# Altium schematic sheet main.SchDoc
size C
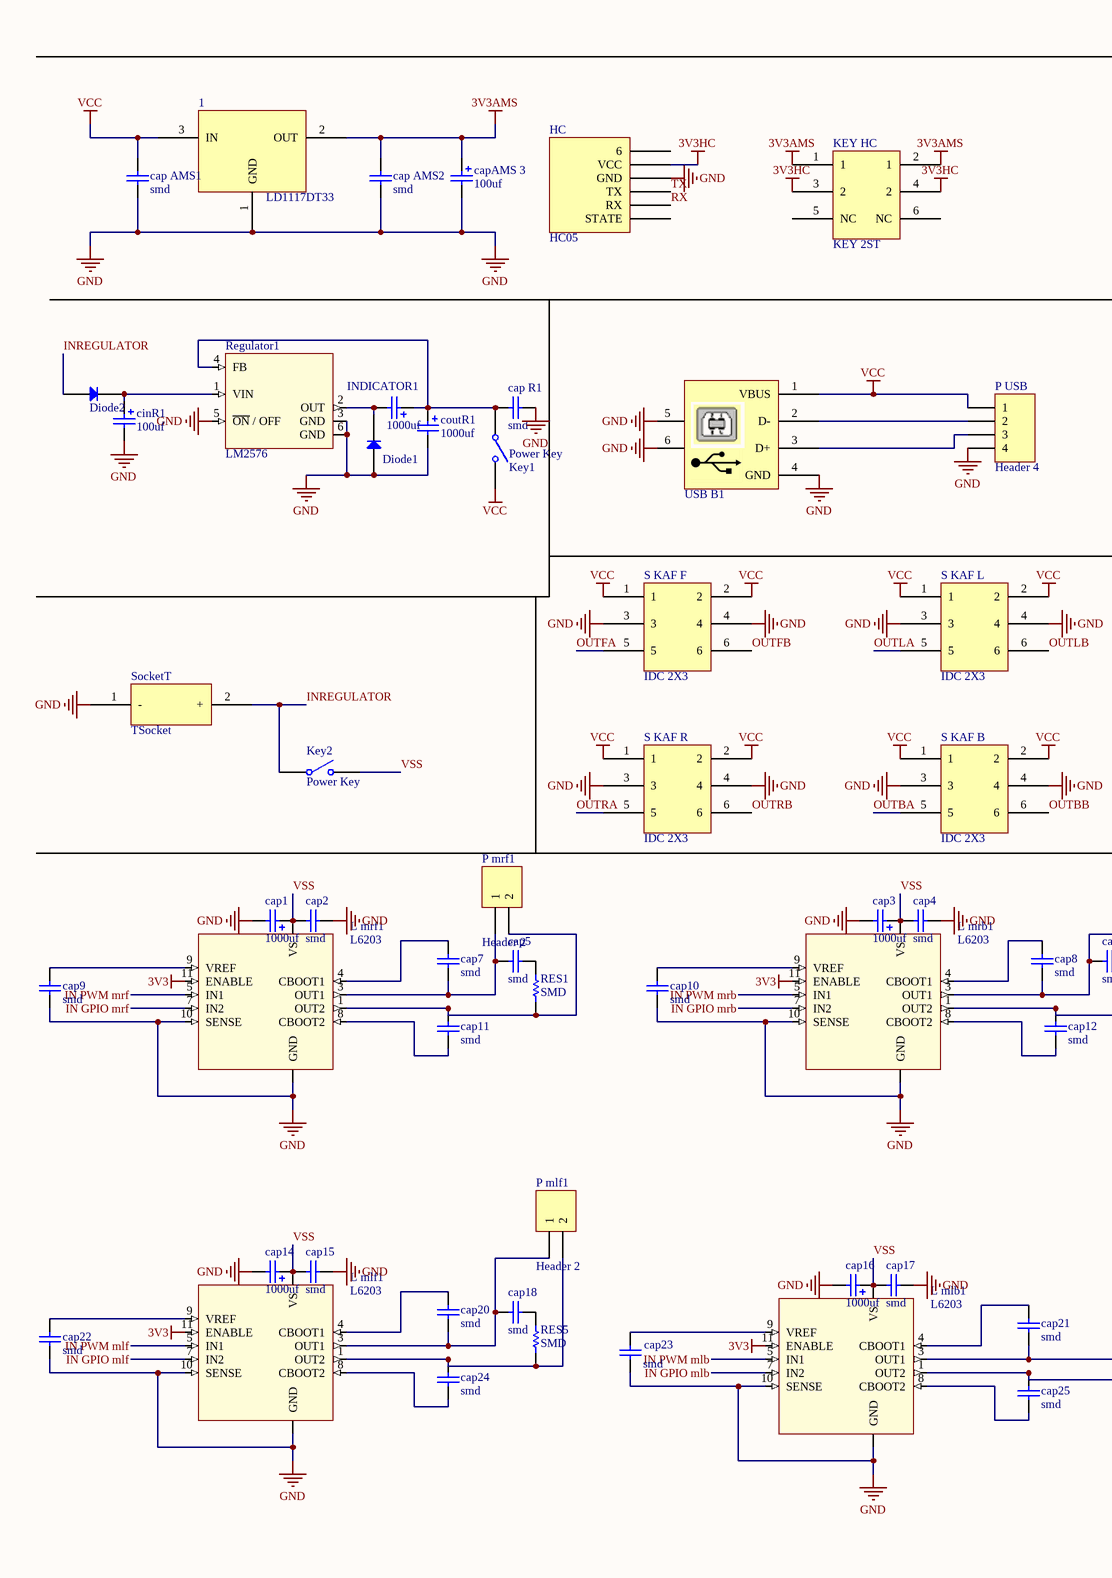
[diagram p0: main.SchDoc, left]
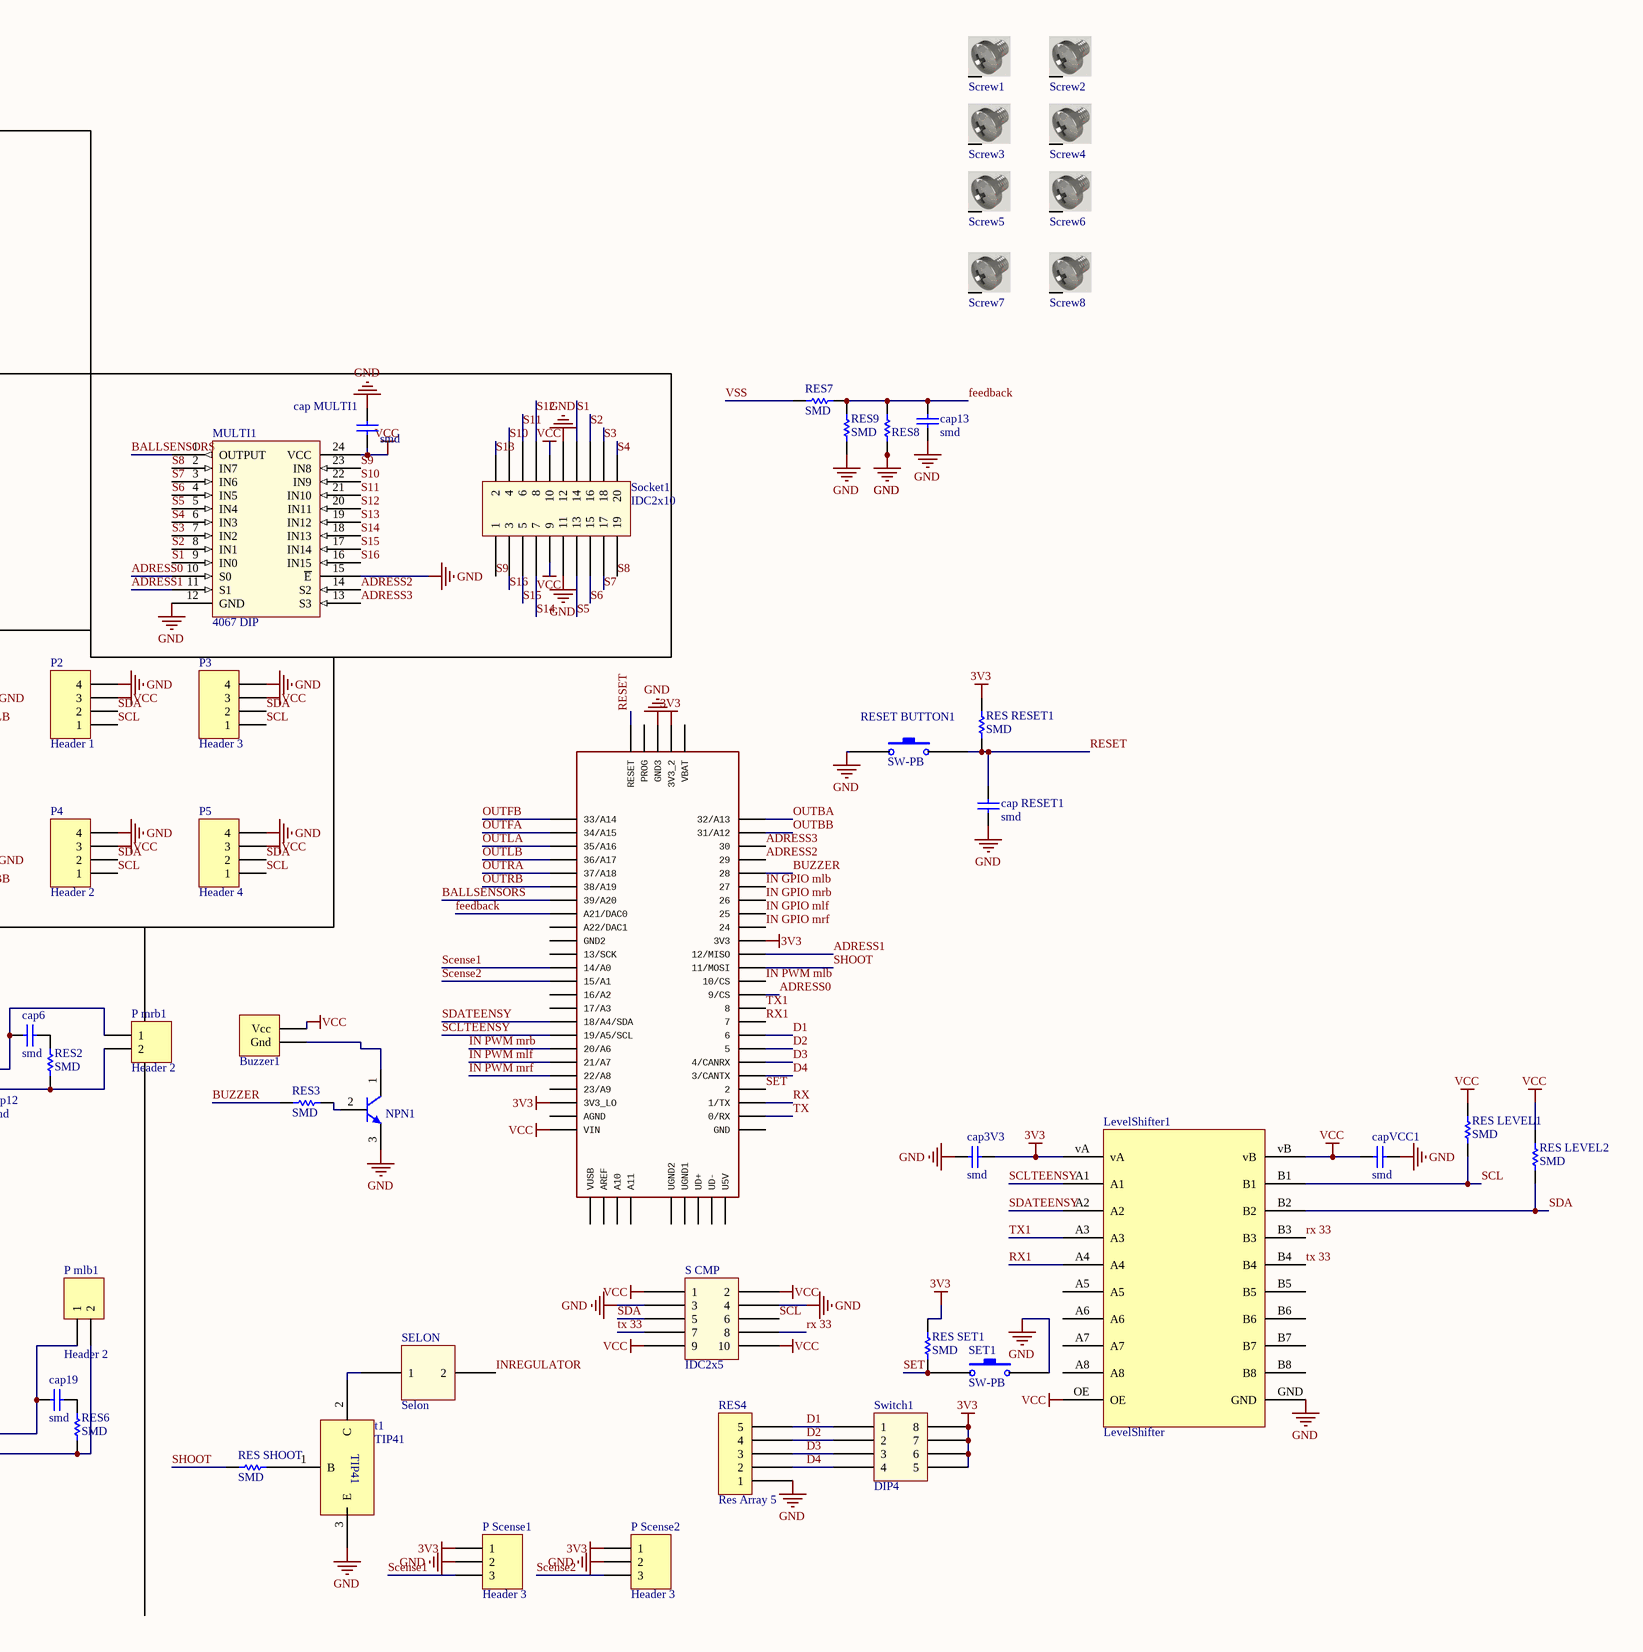
[diagram p1: main.SchDoc, right]

## Parts
1  LD1117DT33  [SOT223]
2  TEENSY_3.5/3.6  [TEENSY_3.5/3.6]  (value not drawn)
Buzzer1  Buzzer  [Buzzer]  (value not drawn)
cap1  1000uf  [Cap 1000uf]
cap2  smd  [Cap SMD]
cap3  1000uf  [Cap 1000uf]
cap3V3  smd  [Cap SMD]
cap4  smd  [Cap SMD]
cap5  smd  [Cap SMD]
cap6  smd  [Cap SMD]
cap7  smd  [Cap SMD]
cap8  smd  [Cap SMD]
cap9  smd  [Cap SMD]
cap10  smd  [Cap SMD]
cap11  smd  [Cap SMD]
cap12  smd  [Cap SMD]
cap13  smd  [Cap SMD]
cap14  1000uf  [Cap 1000uf]
cap15  smd  [Cap SMD]
cap16  1000uf  [Cap 1000uf]
cap17  smd  [Cap SMD]
cap18  smd  [Cap SMD]
cap19  smd  [Cap SMD]
cap20  smd  [Cap SMD]
cap21  smd  [Cap SMD]
cap22  smd  [Cap SMD]
cap23  smd  [Cap SMD]
cap24  smd  [Cap SMD]
cap25  smd  [Cap SMD]
cap_AMS1  smd  [Cap SMD]
cap_AMS2  smd  [Cap SMD]
cap_MULTI1  smd  [Cap SMD]
cap_R1  smd  [Cap SMD]
cap_RESET1  smd  [Cap SMD]
capAMS_3  100uf  [Cap 100uF]
capVCC1  smd  [Cap SMD]
cinR1  100uf  [Cap 100uF]
coutR1  1000uf  [Cap 1000uf]
Diode1  Diode  [Diode]  (value not drawn)
Diode2  Diode  [Diode]  (value not drawn)
HC  HC05  [HC05]
INDICATOR1  1000uf  [Cap 1000uf]
Key1  Power Key  [Power Key]
Key2  Power Key  [Power Key]
KEY_HC  KEY 2ST  [KEY 2ST]
L_mlb1  L6203  [MultiWatt11]
L_mlf1  L6203  [MultiWatt11]
L_mrb1  L6203  [MultiWatt11]
L_mrf1  L6203  [MultiWatt11]
LevelShifter1  LevelShifter  [CJMCU]
MULTI1  4067 DIP  [4067 DIP]
NPN1  N2222A  [NPN]  (value not drawn)
P2  Header 1  [HDR1X4]
P3  Header 3  [HDR1X4]
P4  Header 2  [HDR1X4]
P5  Header 4  [HDR1X4]
P_mlb1  Header 2  [HDR1X2]
P_mlf1  Header 2  [HDR1X2]
P_mrb1  Header 2  [HDR1X2]
P_mrf1  Header 2  [HDR1X2]
P_Scense1  Header 3  [HDR1X3]
P_Scense2  Header 3  [HDR1X3]
P_USB  Header 4  [HDR1X4]
Regulator1  LM2576  [D2PAK]
RES1  SMD  [Resistor SMD 1206]
RES2  SMD  [Resistor SMD 1206]
RES3  SMD  [Resistor SMD 1206]
RES4  Res Array 5  [Res Array 5]
RES5  SMD  [Resistor SMD 1206]
RES6  SMD  [Resistor SMD 1206]
RES7  SMD  [Resistor SMD 1206]
RES8  DIP  [Resistor]  (value not drawn)
RES9  SMD  [Resistor SMD 1206]
RES_LEVEL1  SMD  [Resistor SMD 1206]
RES_LEVEL2  SMD  [Resistor SMD 1206]
RES_RESET1  SMD  [Resistor SMD 1206]
RES_SET1  SMD  [Resistor SMD 1206]
RES_SHOOT  SMD  [Resistor SMD 1206]
RESET_BUTTON1  SW-PB  [SW_2pin]
S_CMP  IDC2x5  [IDC 2x5]
S_KAF_B  IDC 2X3  [IDC 2X3]
S_KAF_F  IDC 2X3  [IDC 2X3]
S_KAF_L  IDC 2X3  [IDC 2X3]
S_KAF_R  IDC 2X3  [IDC 2X3]
Screw1  Screw  [Screw]  (value not drawn)
Screw2  Screw  [Screw]  (value not drawn)
Screw3  Screw  [Screw]  (value not drawn)
Screw4  Screw  [Screw]  (value not drawn)
Screw5  Screw  [Screw]  (value not drawn)
Screw6  Screw  [Screw]  (value not drawn)
Screw7  Screw  [Screw]  (value not drawn)
Screw8  Screw  [Screw]  (value not drawn)
SELON  Selon  [Selon Con]
SET1  SW-PB  [SW_2pin]
Socket1  IDC2x10  [IDC 2x10]
SocketT  TSocket  [TSocket]
Switch1  DIP4  [DIP SW4]
t1  TIP41  [TIP41]
USB_B1  USB_B  [USB_B.2]  (value not drawn)

## Nets
3V3: 2.3V3 2.3V3_2 2.3V3_LO cap3V3.2 L_mlb1.11(ENABLE) L_mlf1.11(ENABLE) L_mrb1.11(ENABLE) L_mrf1.11(ENABLE) LevelShifter1.vA P_Scense1.1 P_Scense2.1 RES_RESET1.2 RES_SET1.2 Switch1.5 Switch1.6 Switch1.7 Switch1.8
3V3AMS: 1.2(OUT) cap_AMS2.2 capAMS_3.1 KEY_HC.1 KEY_HC.2(1)
3V3HC: HC.5(VCC) KEY_HC.3(2) KEY_HC.4(2)
GND: 1.1(GND) 2.GND3 cap1.2 cap2.2 cap3.2 cap3V3.1 cap4.2 cap9.1 cap10.1 cap13.2 cap14.2 cap15.2 cap16.2 cap17.2 cap22.1 cap23.1 cap_AMS1.2 cap_AMS2.1 cap_MULTI1.2 cap_R1.2 cap_RESET1.2 capAMS_3.2 capVCC1.2 cinR1.2 coutR1.2 Diode1.1(A) HC.4(GND) L_mlb1.6(GND) L_mlb1.10(SENSE) L_mlf1.6(GND) L_mlf1.10(SENSE) L_mrb1.6(GND) L_mrb1.10(SENSE) L_mrf1.6(GND) L_mrf1.10(SENSE) LevelShifter1.GND MULTI1.12(GND) MULTI1.15(~{E}) NPN1.3(E) P2.4 P3.4 P4.4 P5.4 P_Scense1.2 P_Scense2.2 P_USB.4 Regulator1.3(GND) Regulator1.5(~{ON}_/_OFF) Regulator1.6(GND) RES4.1 RES8.1 RES9.1 RESET_BUTTON1.2 S_CMP.3 S_CMP.4 S_KAF_B.3 S_KAF_B.4 S_KAF_F.3 S_KAF_F.4 S_KAF_L.3 S_KAF_L.4 S_KAF_R.3 S_KAF_R.4 SET1.1 Socket1.11 Socket1.12 SocketT.1(-) t1.3(E) USB_B1.4(GND) USB_B1.5 USB_B1.6
VCC: 1.3(IN) 2.VIN Buzzer1.1(Vcc) cap_AMS1.1 cap_MULTI1.1 capVCC1.1 Key1.2(NO) LevelShifter1.OE LevelShifter1.vB MULTI1.24(VCC) P2.3 P3.3 P4.3 P5.3 P_USB.1 RES_LEVEL1.2 RES_LEVEL2.2 S_CMP.1 S_CMP.2 S_CMP.9 S_CMP.10 S_KAF_B.1 S_KAF_B.2 S_KAF_F.1 S_KAF_F.2 S_KAF_L.1 S_KAF_L.2 S_KAF_R.1 S_KAF_R.2 Socket1.9 Socket1.10 USB_B1.1(VBUS)
ADRESS0: 2.9/CS MULTI1.10(S0)
ADRESS1: 2.12/MISO MULTI1.11(S1)
ADRESS2: 2.29 MULTI1.14(S2)
ADRESS3: 2.30 MULTI1.13(S3)
BALLSENSORS: 2.39/A20 MULTI1.1(OUTPUT)
BUZZER: 2.28 RES3.2
D1: 2.6 RES4.5 Switch1.1
D2: 2.5 RES4.4 Switch1.2
D3: 2.4/CANRX RES4.3 Switch1.3
D4: 2.3/CANTX RES4.2 Switch1.4
feedback: 2.21/DAC0(A21/DAC0) cap13.1 RES7.2 RES8.2 RES9.2
IN GPIO mlb: 2.27 L_mlb1.7(IN2)
IN GPIO mlf: 2.25 L_mlf1.7(IN2)
IN GPIO mrb: 2.26 L_mrb1.7(IN2)
IN GPIO mrf: 2.24 L_mrf1.7(IN2)
IN PWM mlb: 2.10/CS L_mlb1.5(IN1)
IN PWM mlf: 2.21/A7 L_mlf1.5(IN1)
IN PWM mrb: 2.20/A6 L_mrb1.5(IN1)
IN PWM mrf: 2.22/A8 L_mrf1.5(IN1)
INREGULATOR: Diode2.1(A) Key2.1(COMMON) SELON.2 SocketT.2(+)
OUTBA: 2.32/A13 S_KAF_B.5
OUTBB: 2.31/A12 S_KAF_B.6
OUTFA: 2.34/A15 S_KAF_F.5
OUTFB: 2.33/A14 S_KAF_F.6
OUTLA: 2.35/A16 S_KAF_L.5
OUTLB: 2.36/A17 S_KAF_L.6
OUTRA: 2.37/A18 S_KAF_R.5
OUTRB: 2.38/A19 S_KAF_R.6
RESET: 2.RESET cap_RESET1.1 RES_RESET1.1 RESET_BUTTON1.1
RX: 2.1/TX HC.2(RX)
RX1: 2.7 LevelShifter1.A4
rx 33: LevelShifter1.B3 S_CMP.8
S1: MULTI1.9(IN0) Socket1.14
S2: MULTI1.8(IN1) Socket1.16
S3: MULTI1.7(IN2) Socket1.18
S4: MULTI1.6(IN3) Socket1.20
S5: MULTI1.5(IN4) Socket1.13
S6: MULTI1.4(IN5) Socket1.15
S7: MULTI1.3(IN6) Socket1.17
S8: MULTI1.2(IN7) Socket1.19
S9: MULTI1.23(IN8) Socket1.1
S10: MULTI1.22(IN9) Socket1.4
S11: MULTI1.21(IN10) Socket1.6
S12: MULTI1.20(IN11) Socket1.8
S13: MULTI1.19(IN12) Socket1.2
S14: MULTI1.18(IN13) Socket1.7
S15: MULTI1.17(IN14) Socket1.5
S16: MULTI1.16(IN15) Socket1.3
Scense1: 2.14/A0 P_Scense1.3
Scense2: 2.15/A1 P_Scense2.3
SCL: LevelShifter1.B1 P2.1 P3.1 P4.1 P5.1 RES_LEVEL1.1 S_CMP.6
SCLTEENSY: 2.19/A5/SCL LevelShifter1.A1
SDA: LevelShifter1.B2 P2.2 P3.2 P4.2 P5.2 RES_LEVEL2.1 S_CMP.5
SDATEENSY: 2.18/A4/SDA LevelShifter1.A2
SET: 2.2 RES_SET1.1 SET1.2
SHOOT: 2.11/MOSI RES_SHOOT.2
TX: 2.0/RX HC.3(TX)
TX1: 2.8 LevelShifter1.A3
tx 33: LevelShifter1.B4 S_CMP.7
VSS: cap1.1 cap2.1 cap3.1 cap4.1 cap14.1 cap15.1 cap16.1 cap17.1 Key2.2(NO) L_mlb1.2(VS) L_mlf1.2(VS) L_mrb1.2(VS) L_mrf1.2(VS) RES7.1
NetBuzzer1_2: Buzzer1.2(Gnd) NPN1.1(C)
Netcap5_1: cap5.1 cap7.1 L_mrf1.3(OUT1) P_mrf1.1
Netcap5_2: cap5.2 RES1.1
Netcap6_1: cap6.1 cap8.1 L_mrb1.3(OUT1) P_mrb1.1
Netcap6_2: cap6.2 RES2.1
Netcap7_2: cap7.2 L_mrf1.4(CBOOT1)
Netcap8_2: cap8.2 L_mrb1.4(CBOOT1)
Netcap9_2: cap9.2 L_mrf1.9(VREF)
Netcap10_2: cap10.2 L_mrb1.9(VREF)
Netcap11_1: cap11.1 L_mrf1.8(CBOOT2)
Netcap11_2: cap11.2 L_mrf1.1(OUT2) P_mrf1.2 RES1.2
Netcap12_1: cap12.1 L_mrb1.8(CBOOT2)
Netcap12_2: cap12.2 L_mrb1.1(OUT2) P_mrb1.2 RES2.2
Netcap18_1: cap18.1 cap20.1 L_mlf1.3(OUT1) P_mlf1.1
Netcap18_2: cap18.2 RES5.1
Netcap19_1: cap19.1 cap21.1 L_mlb1.3(OUT1) P_mlb1.1
Netcap19_2: cap19.2 RES6.1
Netcap20_2: cap20.2 L_mlf1.4(CBOOT1)
Netcap21_2: cap21.2 L_mlb1.4(CBOOT1)
Netcap22_2: cap22.2 L_mlf1.9(VREF)
Netcap23_2: cap23.2 L_mlb1.9(VREF)
Netcap24_1: cap24.1 L_mlf1.8(CBOOT2)
Netcap24_2: cap24.2 L_mlf1.1(OUT2) P_mlf1.2 RES5.2
Netcap25_1: cap25.1 L_mlb1.8(CBOOT2)
Netcap25_2: cap25.2 L_mlb1.1(OUT2) P_mlb1.2 RES6.2
Netcap_R1_1: cap_R1.1 coutR1.1 INDICATOR1.1 Key1.1(COMMON) Regulator1.4(FB)
NetcinR1_1: cinR1.1 Diode2.2(K) Regulator1.1(VIN)
NetDiode1_2: Diode1.2(K) INDICATOR1.2 Regulator1.2(OUT)
NetNPN1_2: NPN1.2(B) RES3.1
NetP_USB_2: P_USB.2 USB_B1.2(D-)
NetP_USB_3: P_USB.3 USB_B1.3(D+)
NetRES_SHOOT_1: RES_SHOOT.1 t1.1(B)
NetSELON_1: SELON.1 t1.2(C)

Not connected (* = marked no-connect by the designer): 2 13/SCK 16/A2 17/A3 23/A9 A10 A11 A22/DAC1 AGND AREF GND GND2 PROG U5V UD+ UD- UGND1 UGND2 VBAT VUSB; HC 1(STATE) 6; KEY_HC 5(NC) 6(NC); LevelShifter1 A5 A6 A7 A8 B5 B6 B7 B8; Screw1 S; Screw2 S; Screw3 S; Screw4 S; Screw5 S; Screw6 S; Screw7 S; Screw8 S

## Library data of the parts
2 = TEENSY_3.5/3.6: GateName_1: G$1; SymbolName_1: TEENSY_3.5/3.6; LibraryName: Teensy356; DeviceSetName: TEENSY_3.5/3.6; Package: TEENSY_3.5/3.6
cap1 cap3 cap14 cap16 coutR1 INDICATOR1 = Cap 1000uF
cap2 cap3V3 cap4-cap13 cap15 cap17-cap25 cap_AMS1 cap_AMS2 cap_MULTI1 cap_R1 cap_RESET1 capVCC1 = Cap SMD
capAMS_3 cinR1 = Cap 100uF
NPN1 = NPN
P2-P5 P_USB = Header 4: Header, 4-Pin; LatestRevisionDate: 17-Jul-2002; LatestRevisionNote: Re-released for DXP Platform.; Publisher: Altium Limited
P_mlb1 P_mlf1 P_mrb1 P_mrf1 = Header 2: Header, 2-Pin; LatestRevisionDate: 17-Jul-2002; LatestRevisionNote: Re-released for DXP Platform.; Publisher: Altium Limited
P_Scense1 P_Scense2 = Header 3: Header, 3-Pin; LatestRevisionDate: 17-Jul-2002; LatestRevisionNote: Re-released for DXP Platform.; Publisher: Altium Limited
RES1-RES3 RES5-RES7 RES9 RES_LEVEL1 RES_LEVEL2 RES_RESET1 RES_SET1 RES_SHOOT = Res SMD
RES8 = Res
RESET_BUTTON1 SET1 = SW-PB: Switch; Published: 24-Mar-1999; LatestRevisionDate: 17-Jul-2002; LatestRevisionNote: Re-released for DXP Platform.; PackageReference: SPST-2; Publisher: Altium Limited; PackageDescription: Switch; 2 Leads
S_CMP = IDC 2x5
Socket1 = IDC 2x10
Switch1 = DIP SW 4
USB_B1 = USB_B: USB B; LatestRevisionDate: 17-Jul-2002; LatestRevisionNote: Re-released for DXP Platform.; Publisher: Altium Limited
Screw1-Screw8 = Screw: LatestRevisionDate: 17-Jul-2002; LatestRevisionNote: Re-released for DXP Platform.; Publisher: Altium Limited